# EAGLE design RCSfullschematic3 (EAGLE 7.6.0)
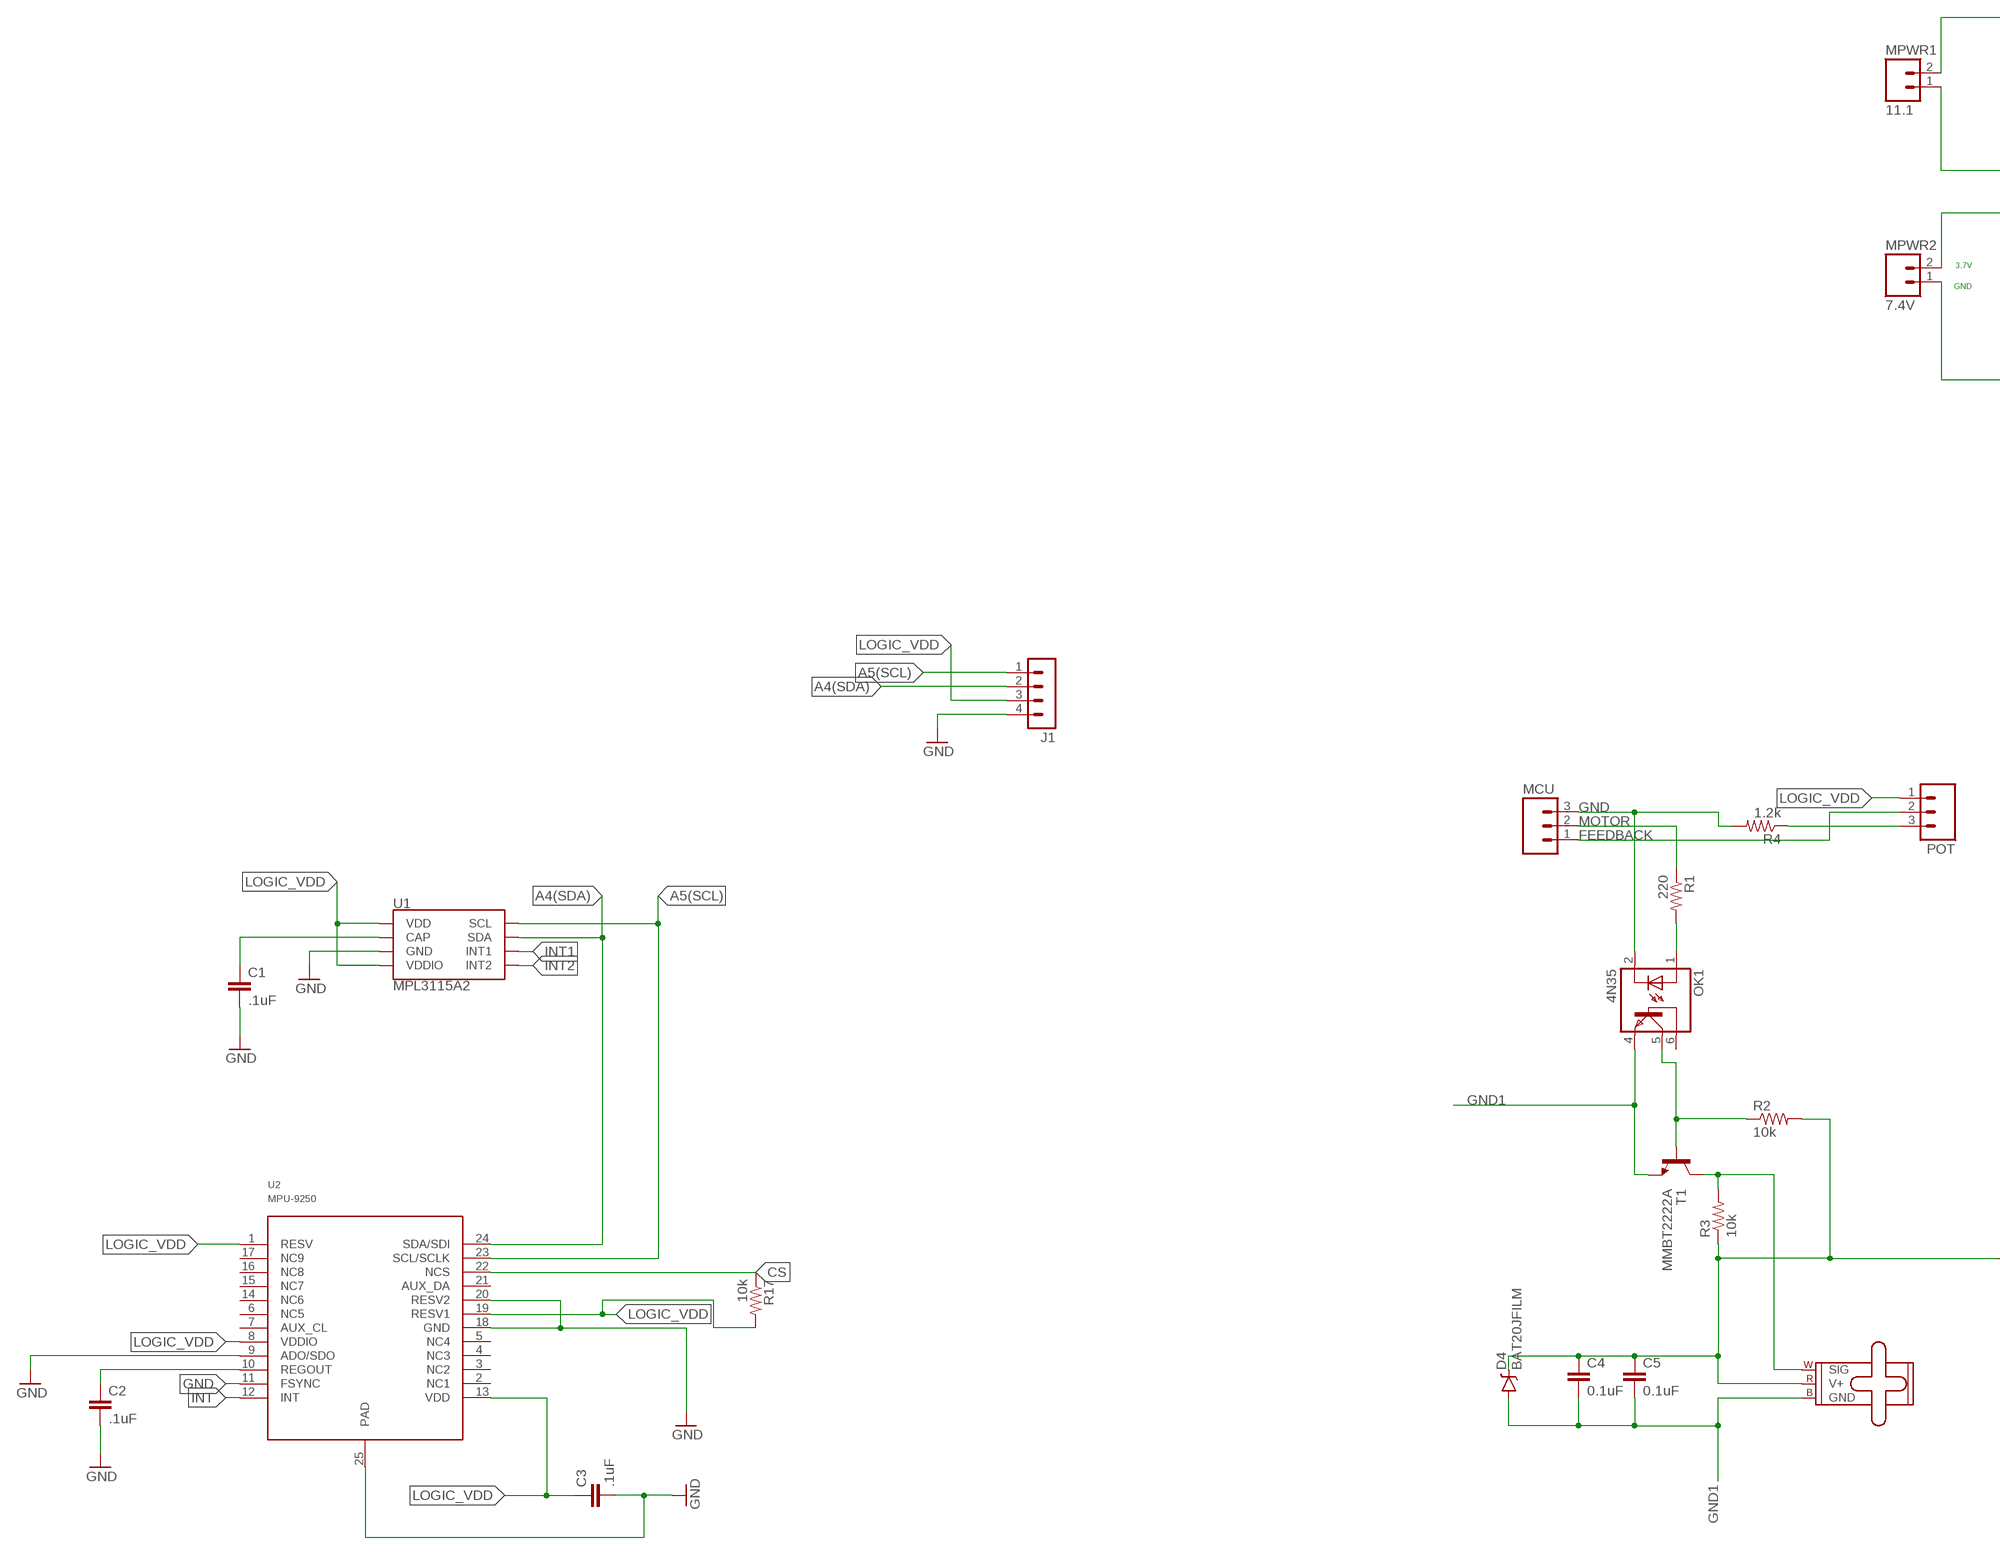
[diagram p0: schematic, sheet 1, part 1 of 2]
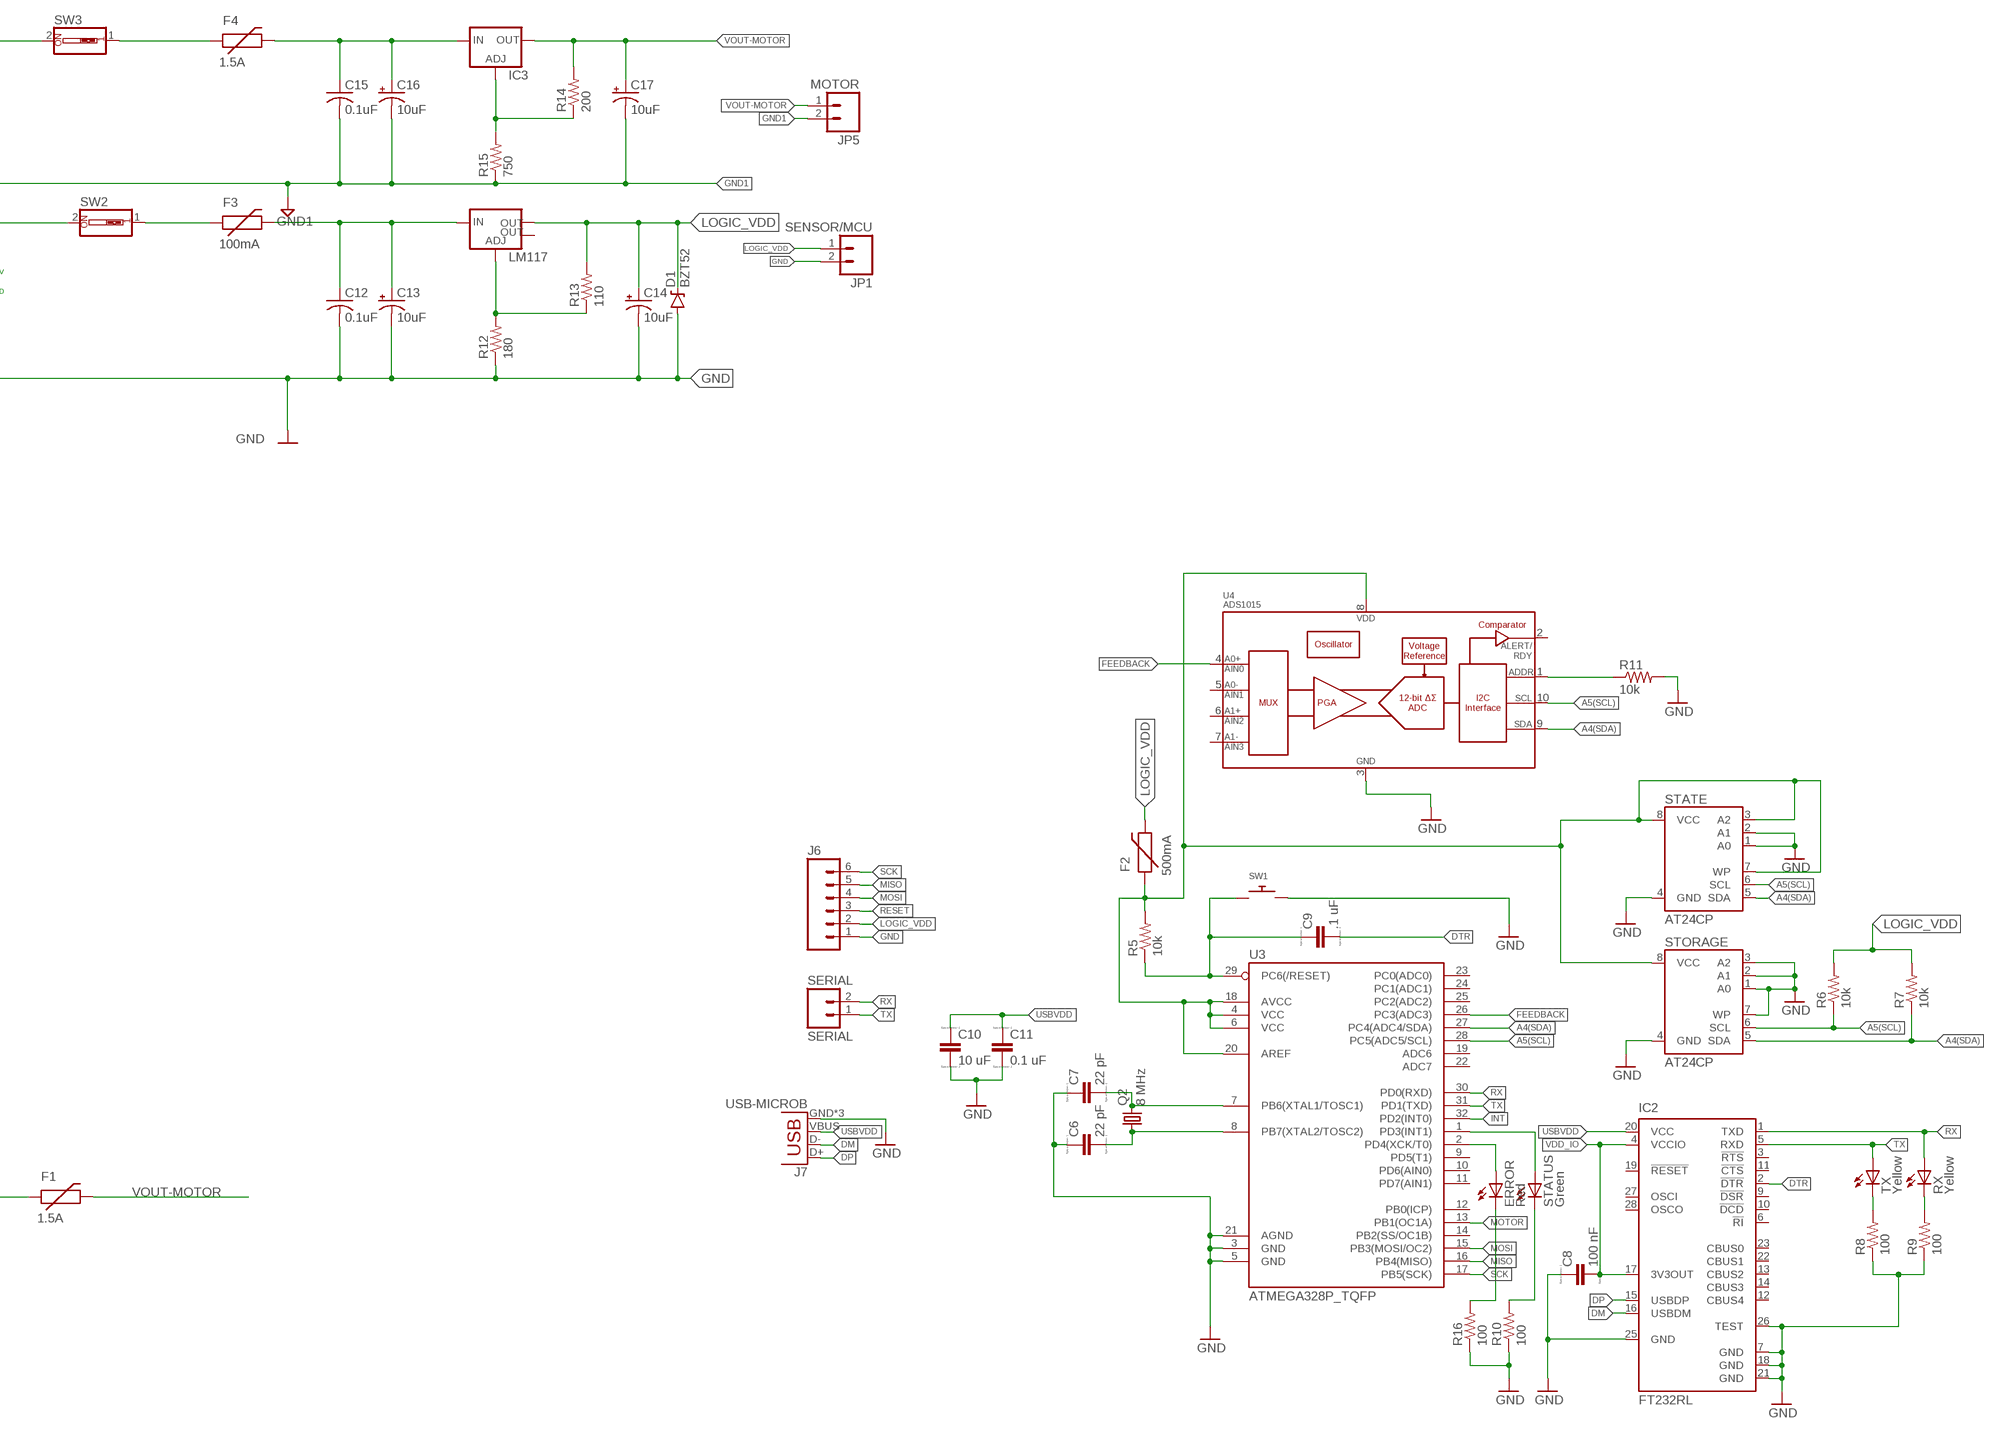
[diagram p1: schematic, sheet 1, part 2 of 2]

## Parts
C1  .1uF  10UF-1206-6.3V-20%  [1206]
C2  .1uF  10UF-1206-6.3V-20%  [1206]
C3  .1uF  10UF-1206-6.3V-20%  [1206]
C4  0.1uF  CAP1206  [1206]
C5  0.1uF  CAP1206  [1206]
C6  22 pF  CC1206  [C1206]
C7  22 pF  CC1206  [C1206]
C8  100 nF  CC1206  [C1206]
C9  .1 uF  CC1206  [C1206]
C10  10 uF  CC1206  [C1206]
C11  0.1 uF  CC1206  [C1206]
C12  0.1uF  C-USC1206  [C1206]
C13  10uF  10UF-POLAR-EIA3216-16V-10%(TANT)  [EIA3216]
C14  10uF  10UF-POLAR-EIA3216-16V-10%(TANT)  [EIA3216]
C15  0.1uF  C-USC1206  [C1206]
C16  10uF  10UF-POLAR-EIA3216-16V-10%(TANT)  [EIA3216]
C17  10uF  10UF-POLAR-EIA3216-16V-10%(TANT)  [EIA3216]
D1  BZT52  DIODE-ZENER  [DIODE-BZT52]
D4  BAT20JFILM  [SOD-323]
ERROR  Red  LEDCHIPLED_1206  [CHIPLED_1206]
F1  1.5A  PTCSMD  [PTC-1206]
F2  500mA  PTCSMD  [PTC-1206]
F3  100mA  PTCSMD  [PTC-1206]
F4  1.5A  PTCSMD  [PTC-1206]
IC2  FT232RL  [SSOP28]
IC3  LM317TS  [317TS]
J1  MA04-1  [MA04-1]
J6  M06LOCK  [1X06_LOCK]
J7  USB-MICROB  [USB-MICROB]
JP1  SENSOR/MCU  M02PTH  [1X02]
JP5  MOTOR  M02PTH  [1X02]
LM117  V_REG_LM1117SOT223  [SOT223]
MCU  M03PTH  [1X03]
MPWR1  11.1  M02PTH  [1X02]
MPWR2  7.4V  M02PTH  [1X02]
OK1  4N35  [DIL06]
POT  M03PTH  [1X03]
Q2  8 MHz  CRYSTALHC49S  [HC49/S]
R1  220  RESISTOR1206  [1206]
R2  10k  RESISTOR1206  [1206]
R3  10k  RESISTOR1206  [1206]
R4  1.2k  RESISTOR1206  [1206]
R5  10k  R-US_R1206  [R1206]
R6  10k  R-US_R1206  [R1206]
R7  10k  R-US_R1206  [R1206]
R8  100  R-US_R1206  [R1206]
R9  100  R-US_R1206  [R1206]
R10  100  R-US_R1206  [R1206]
R11  10k  R-US_R1206  [R1206]
R12  180  R-US_M1206  [M1206]
R13  110  R-US_M1206  [M1206]
R14  200  R-US_M1206  [M1206]
R15  750  R-US_M1206  [M1206]
R16  100  R-US_R1206  [R1206]
R17  10k  RESISTOR1206  [1206]
RX  Yellow  LEDCHIPLED_1206  [CHIPLED_1206]
SERIAL  SERIAL  M02PTH  [1X02]
SERVO  SMALL_SERVO  [1X03]
STATE  AT24CP  [DIL08]
STATUS  Green  LEDCHIPLED_1206  [CHIPLED_1206]
STORAGE  AT24CP  [DIL08]
SW1  SWITCH_PUSHBUTTONSOFTTOUCHSMD_SJ  [PUSHBUTTON_SMD_SJ]
SW2  SW_DIP-1  [EDG-01]
SW3  SW_DIP-1  [EDG-01]
T1  MMBT2222A  TRANSISTOR_NPNMMBT2222A  [SOT23-3]
TX  Yellow  LEDCHIPLED_1206  [CHIPLED_1206]
U1  MPL3115A2  [LGA-8]
U2  MPU-9250  [LEAD-QFN24]
U3  ATMEGA328P_TQFP  [TQFP32-08]
U4  ADS1015  [MSOP10]

## Nets
6V_POWER [Motor]: C4.1 C5.1 D4.C F1.1 R2.2 R3.1 SERVO.2(V+)
A4(SDA): J1.2 R7.1 STATE.5(SDA) STORAGE.5(SDA) U1.7(SDA) U2.24(SDA/SDI) U3.27(PC4(ADC4/SDA)) U4.9(SDA)
A5(SCL): J1.1 R6.1 STATE.6(SCL) STORAGE.6(SCL) U1.8(SCL) U2.23(SCL/SCLK) U3.28(PC5(ADC5/SCL)) U4.10(SCL)
CS: R17.1 U2.22(NCS)
DM: IC2.16(USBDM) J7.D-
DP: IC2.15(USBDP) J7.D+
DTR: C9.2 IC2.2(!DTR)
FEEDBACK: MCU.1 POT.2 U3.26(PC3(ADC3)) U4.4(AIN0)
GND: C1.2 C2.2 C3.2 C6.1 C7.1 C8.1 C10.2 C11.2 C12.2 C13.- C14.- D1.A IC2.7(GND) IC2.18(GND) IC2.21(GND) IC2.25(GND) IC2.26(TEST) J1.4 J6.1 J7.GND J7.MT1(GND) J7.MT2(GND) JP1.2 MCU.3 MPWR2.1 OK1.2(C) R4.2 R8.1 R9.1 R10.1 R11.2 R12.1 R16.1 STATE.1(A0) STATE.2(A1) STATE.4(GND) STORAGE.1(A0) STORAGE.2(A1) STORAGE.3(A2) STORAGE.4(GND) STORAGE.7(WP) SW1.P$2 U1.3(GND) U2.9(ADO/SDO) U2.11(FSYNC) U2.18(GND) U2.20(RESV2) U2.25(PAD) U3.3(GND) U3.5(GND) U3.21(AGND) U4.3(VSS)
GND1 [Motor]: C4.2 C5.2 C15.2 C16.- C17.- D4.A JP5.2 MPWR1.1 OK1.4(EMI) R15.1 SERVO.3(GND) T1.2(E)
INT: U2.12(INT) U3.32(PD2(INT0))
INT1: U1.6(INT1)
INT2: U1.5(INT2)
LOGIC_VDD: C3.1 C14.+ D1.C F2.2 J1.3 J6.2 JP1.1 LM117.2(OUT) POT.1 R6.2 R7.2 R13.2 R17.2 U1.1(VDD) U1.4(VDDIO) U2.1(RESV) U2.8(VDDIO) U2.13(VDD) U2.19(RESV1)
MISO: J6.5 U3.16(PB4(MISO))
MOSI: J6.4 U3.15(PB3(MOSI/OC2))
MOTOR: MCU.2 R1.1 U3.13(PB1(OC1A))
N$1: C1.1 U1.2(CAP)
N$2 [Motor]: OK1.5(COL) R2.1 T1.1(B)
N$3: C2.1 U2.10(REGOUT)
N$5: POT.3 R4.1
N$6: R11.1 U4.1(ADDR)
N$7: OK1.1(A) R1.2
N$8: C7.2 Q2.2 U3.7(PB6(XTAL1/TOSC1))
N$9: C6.2 Q2.1 U3.8(PB7(XTAL2/TOSC2))
N$10: R8.2 TX.C
N$11: R9.2 RX.C
N$12: STATUS.A U3.1(PD3(INT1))
N$13: R10.2 STATUS.C
N$14: ERROR.C R16.2
N$15: LM117.1(ADJ) R12.2 R13.1
N$16: MPWR2.2 SW2.2
N$17: C12.1 C13.+ F3.2 LM117.3(IN)
N$18: F3.1 SW2.1
N$19 [Motor]: MPWR1.2 SW3.2
N$20 [Motor]: F4.1 SW3.1
N$21 [Motor]: C15.1 C16.+ F4.2 IC3.3(IN)
N$22 [Motor]: IC3.1(ADJ) R14.1 R15.2
N$23: ERROR.A U3.2(PD4(XCK/T0))
RESET: C9.1 J6.3 R5.1 SW1.P$1 U3.29(PC6(/RESET))
RX: IC2.1(TXD) RX.A SERIAL.2 U3.30(PD0(RXD))
SCK: J6.6 U3.17(PB5(SCK))
SIGNAL [Motor]: R3.2 SERVO.1(SIG) T1.3(C)
TX: IC2.5(RXD) SERIAL.1 TX.A U3.31(PD1(TXD))
USBVDD: C10.1 C11.1 IC2.20(VCC) J7.VBUS
VCC: F2.1 R5.2 STATE.3(A2) STATE.7(WP) STATE.8(VCC) STORAGE.8(VCC) U3.4(VCC) U3.6(VCC) U3.18(AVCC) U3.20(AREF) U4.8(VDD)
VDD_IO: C8.2 IC2.4(VCCIO) IC2.17(3V3OUT)
VOUT-MOTOR [Motor]: C17.+ F1.2 IC3.2(OUT) JP5.1 R14.2
Unconnected: IC2.3(!RTS) IC2.6(!RI) IC2.9(!DSR) IC2.10(!DCD) IC2.11(!CTS) IC2.12(CBUS4) IC2.13(CBUS2) IC2.14(CBUS3) IC2.19(!RESET) IC2.22(CBUS1) IC2.23(CBUS0) IC2.27(OSCI) IC2.28(OSCO) LM117.4(OUT) OK1.6(BAS) U2.2(NC1) U2.3(NC2) U2.4(NC3) U2.5(NC4) U2.6(NC5) U2.7(AUX_CL) U2.14(NC6) U2.15(NC7) U2.16(NC8) U2.17(NC9) U2.21(AUX_DA) U3.9(PD5(T1)) U3.10(PD6(AIN0)) U3.11(PD7(AIN1)) U3.12(PB0(ICP)) U3.14(PB2(SS/OC1B)) U3.19(ADC6) U3.22(ADC7) U3.23(PC0(ADC0)) U3.24(PC1(ADC1)) U3.25(PC2(ADC2)) U4.2(ALERT/RDY) U4.5(AIN1) U4.6(AIN2) U4.7(AIN3)

## Notes on the sheet
- 3.7V
- GND

## Library data of the parts
C1-C3 = SparkFun-Capacitors:10UF: 10.0µF ceramic capacitors A capacitor is a passive two-terminal electrical component used to store electrical energy temporarily in an electric field.; PROD_ID: CAP-10057; VALUE: 10uF
C4 C5 = SparkFun-Passives:CAP: Capacitor Standard 0603 ceramic capacitor, and 0.1" leaded capacitor.
C6-C11 = eagle-ltspice:C: CAPACITOR, European symbol; SPICEMODEL: NONE; SPICEPREFIX: C
C12 C15 = rcl:C-US: CAPACITOR, American symbol
C13 C14 C16 C17 = SparkFun-Capacitors:10UF-POLAR: 10.0µF polarized capacitors A capacitor is a passive two-terminal electrical component used to store electrical energy temporarily in an electric field.; PROD_ID: CAP-00811
D1 = SparkFun-DiscreteSemi:DIODE-ZENER: Zener Diode Production Part - 8199 3.4V Zener Voltage; PROD-ID: DIO-08199
D4 = SparkFun-DiscreteSemi:BAT20JFILM: 23V, 1A Schottky diode, SOD-323 package; PROD_ID: DIO-11623
ERROR RX STATUS TX = adafruit:LED: LED OSRAM: - CHIPLED LG R971, LG N971, LY N971, LG Q971, LY Q971, LO R971, LY R971 LH N974, LH R974 LS Q976, LO Q976, LY Q976 LO Q996 - Hyper CHIPLED LW Q18S LB Q993, LB Q99A, LB R99A - SideLED LS A670, LO A670, LY A670, LG A670, LP A670 LB A673, LV A673, LT A673, LW A673 LH A674 LY A675 LS A676, LA A676, LO A676, LY A676, LW A676 LS A679, LY A679, LG A679 - Hyper Micro SIDELED® LS Y876, LA Y876, LO Y876, LY Y876 LT Y87S - SmartLED LW L88C, LW L88S LB L89C, LB L89S, LG L890 LS L89K, LO L89K, LY L89K LS L896, LA L896, LO L896, LY L896 - TOPLED LS T670, LO T670, LY T670, LG T670, LP T670 LSG T670, LSP T670, LSY T670, LOP T670, LYG T670 LG T671, LOG T671, LSG T671 LB T673, LV T673, LT T673, LW T673 LH T674 LS T676, LA T676, LO T676, LY T676, LB T676, LH T676, LSB T676, LW T676 LB T67C, LV T67C, LT T67C, LS T67K, LO T67K, LY T67K, LW E67C LS E67B, LA E67B, LO E67B, LY E67B, LB E67C, LV E67C, LT E67C LW T67C LS T679, LY T679, LG T679 LS T770, LO T770, LY T770, LG T770, LP T770 LB T773, LV T773, LT T773, LW T773 LH T774 LS E675, LA E675, LY E675, LS T675 LS T776, LA T776, LO T776, LY T776, LB T776 LHGB T686 LT T68C, LB T68C - Hyper Mini TOPLED® LB M676 - Mini TOPLED Santana® LG M470 LS M47K, LO M47K, LY M47K Source: http://www.osram.convergy.de/
F1-F4 = SparkFun-PowerIC:PTC: Resettable Fuse PTC Resettable Fuse. Spark Fun Electronics SKU : COM-08357; PROD_ID: RES-11150
IC2 = ftdichip:FT232R: Source: http://www.ftdichip.com/Documents/DataSheets/DS_FT232R_v104.pdf; MPN: FT232RL; OC_FARNELL: 1146032; OC_NEWARK: 91K9918
IC3 = v-reg:LM317TS: VOLTAGE REGULATOR
J1 = con-lstb:MA04-1: PIN HEADER; OC_FARNELL: unknown; OC_NEWARK: unknown
J6 = SparkFun-Connectors:M06: Header 6 Standard 6-pin 0.1" header. Use with straight break away headers (SKU : PRT-00116), right angle break away headers (PRT-00553), swiss pins (PRT-00743), machine pins (PRT-00117), and female headers (PRT-00115). Molex polarized connector foot print use with SKU : PRT-08094 with associated crimp pins and housings. NOTES ON THE VARIANTS LOCK and LOCK_LONGPADS... This footprint was designed to help hold the alignment of a through-hole component (i.e. 6-pin header) while soldering it into place. You may notice that each hole has been shifted either up or down by 0.005 of an inch from it's more standard position (which is a perfectly straight line). This slight alteration caused the pins (the squares in the middle) to touch the edges of the holes. Because they are alternating, it causes a "brace" to hold the component in place. 0.005 has proven to be the perfect amount of "off-center" position when using our standard breakaway headers. Although looks a little odd when you look at the bare footprint, once you have a header in there, the alteration is very hard to notice. Also,if you push a header all the way into place, it is covered up entirely on the bottom side. This idea of altering the position of holes to aid alignment will be further integrated into the Sparkfun Library for other footprints. It can help hold any component with 3 or more connection pins.
J7 = SparkFun-Connectors:USB: USB Connectors USB-B-PTH is fully proven SKU : PRT-00139/CONN-08278 USB-miniB is fully proven SKU : PRT-00587 USB-A-PCB is untested. USB-A-H is throughly reviewed, but untested. Spark Fun Electronics SKU : PRT-00437 USB-B-SMT is throughly reviewed, but untested. Needs silkscreen touching up. USB-A-S has not been used/tested USB-MB-H has not been used/tested USB-MICROB has been used. CONN-09505; PROD_ID: CONN-09505
JP1 JP5 MPWR1 MPWR2 SERIAL = SparkFun-Connectors:M02: Standard 2-pin 0.1" header. Use with - straight break away headers ( PRT-00116) - right angle break away headers (PRT-00553) - swiss pins (PRT-00743) - machine pins (PRT-00117) - female headers (PRT-00115) Molex polarized connector foot print use with: PRT-08233 with associated crimp pins and housings. 2.54_SCREWTERM for use with PRT-10571. 3.5mm Screw Terminal footprints for PRT-08084 5mm Screw Terminal footprints for use with PRT-08432
LM117 = SparkFun-IC-Power:V_REG_LM1117: Voltage Regulator LM1117 Standard adjustable voltage regulator but in SMD form. Spark Fun Electronics SKU : COM-00595; PROD_ID: VREG-08170
MCU POT = SparkFun-Connectors:M03: Header 3 Standard 3-pin 0.1" header. Use with straight break away headers (SKU : PRT-00116), right angle break away headers (PRT-00553), swiss pins (PRT-00743), machine pins (PRT-00117), and female headers (PRT-00115). Molex polarized connector foot print use with SKU : PRT-08232 with associated crimp pins and housings.
OK1 = optocoupler:4N35: MOTOROLA OPTO COUPLER; MF: FAIRCHILD SEMICONDUCTOR; MPN: 4N35; OC_FARNELL: 1328375; OC_NEWARK: 72K9946
Q2 = adafruit:CRYSTAL: CRYSTAL; OC_FARNELL: 1667008; OC_NEWARK: unknown
R1-R4 R17 = SparkFun-Passives:RESISTOR: Resistor Basic schematic elements and footprints for 0603, 1206, and PTH resistors.
R5-R11 R16 = adafruit:R-US_: RESISTOR, American symbol
R12-R15 = rcl:R-US_: RESISTOR, American symbol
SERVO = SparkFun-Electromechanical:SMALL_SERVO: Small servo motor This is the small servo used in the SIK. SKU: ROB-09065
STATE STORAGE = atmel:AT24C*: 2-wire serial EEPROM; MPN: AT24C1024BW-SH-B; OC_FARNELL: 1362646; OC_NEWARK: 03P2044
SW1 = adafruit:SWITCH_PUSHBUTTON: Buttons SOFTTOUCHSMD_SJ - Soft touch temporary push button (Super Junk Akihabara) Compatible with SKPMANE010 [Mouser: 688-SKPMAN] C&K_KSS = Digikey: KSS221GLFS
SW2 SW3 = special:SW_DIP-1: DIP SWITCH
T1 = SparkFun-DiscreteSemi:TRANSISTOR_NPN: Generic NPN BJT MMBT2222A - TRANS-08049 (SOT-23, 1A 40V) MPSA42 - TRANS-09116 (SOT-23, 500mA 300V) MMBT5088LT1G - TRANS-11160 (SOT-23, 50 mA 30V) BC547 - COM-08928 <http://www.sparkfun.com/products/8928> (TO-92 45V 100mA) (1.Collector 2.Base 3.Emitter) 2N3904 - COM-00521 <http://www.sparkfun.com/products/521> (TO-92 40V 200mA) (1.Emitter 2.Base 3.Collector) P2N2222A - COM-12852 <http://www.sparkfun.com/products/12852> (TO-92 40V 600mA) (1.Collector 2.Base 3.Emitter); PROD_ID: TRANS-08049
U1 = SparkFun-Sensors:MPL3115A2: NXP MPL3115A2 Digital Altimeter/Pressure Sensor The MPL3115A2 is a compact piezoresistive absolute pressure sensor with an I2C interface. MPL3115 has a wide operating range of 20kPa to 110 kPa, a range that covers all surface elevations on Earth. The fully internally compensated MEMS in conjunction with an embedded high resolution 24-bit equivalent ADC provide accurate pressure [Pascals] /altitude [meters] and temperature [degrees Celsius] data. Datasheet <http://cdn.sparkfun.com/datasheets/Sensors/Pressure/MPL3115A2.pdf> SparkFun Products SparkFun Altitude/Pressure Sensor Breakout - MPL3115A2 <https://www.sparkfun.com/products/11084> (SEN-11084) SparkFun Weather Shield <https://www.sparkfun.com/products/12081> (DEV-12081) SparkFun Photon Weather Shield <https://www.sparkfun.com/products/13630> (DEV-13630); PROD_ID: IC-10869
U2 = invensense copy:MPU-9250
U3 = SparkFun-DigitalIC:ATMEGA328P_TQFP; PROD_ID: IC-09069
U4 = SparkFun-AnalogIC:ADS1015: 12-Bit Del-Sig ADC Four single-ended inputs or two differential inputs Internal PGA I2C interface 2.0-5.5V; PROD_ID: IC-12239

## Net classes
1 Motor: width 0.699 mm

## Board
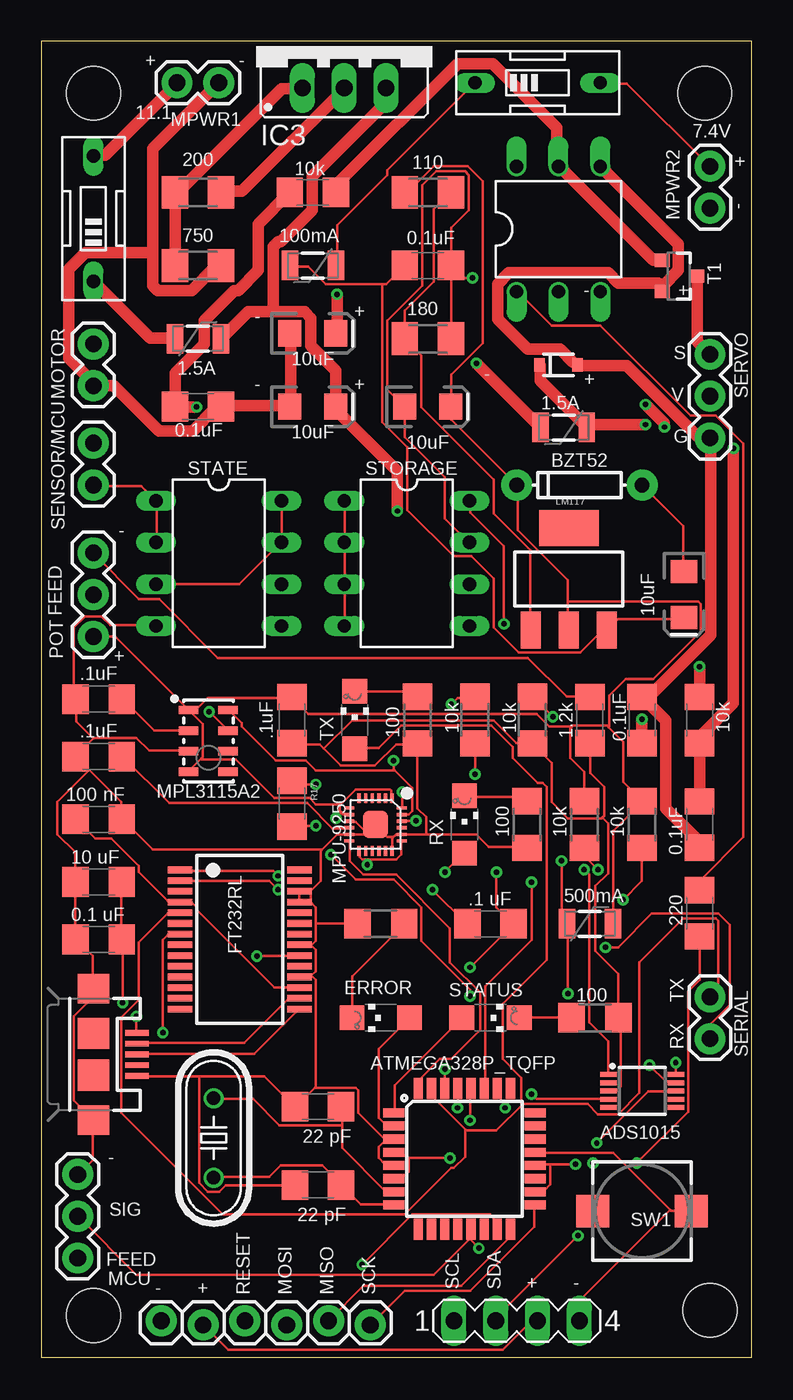
[diagram p2: board, top side]
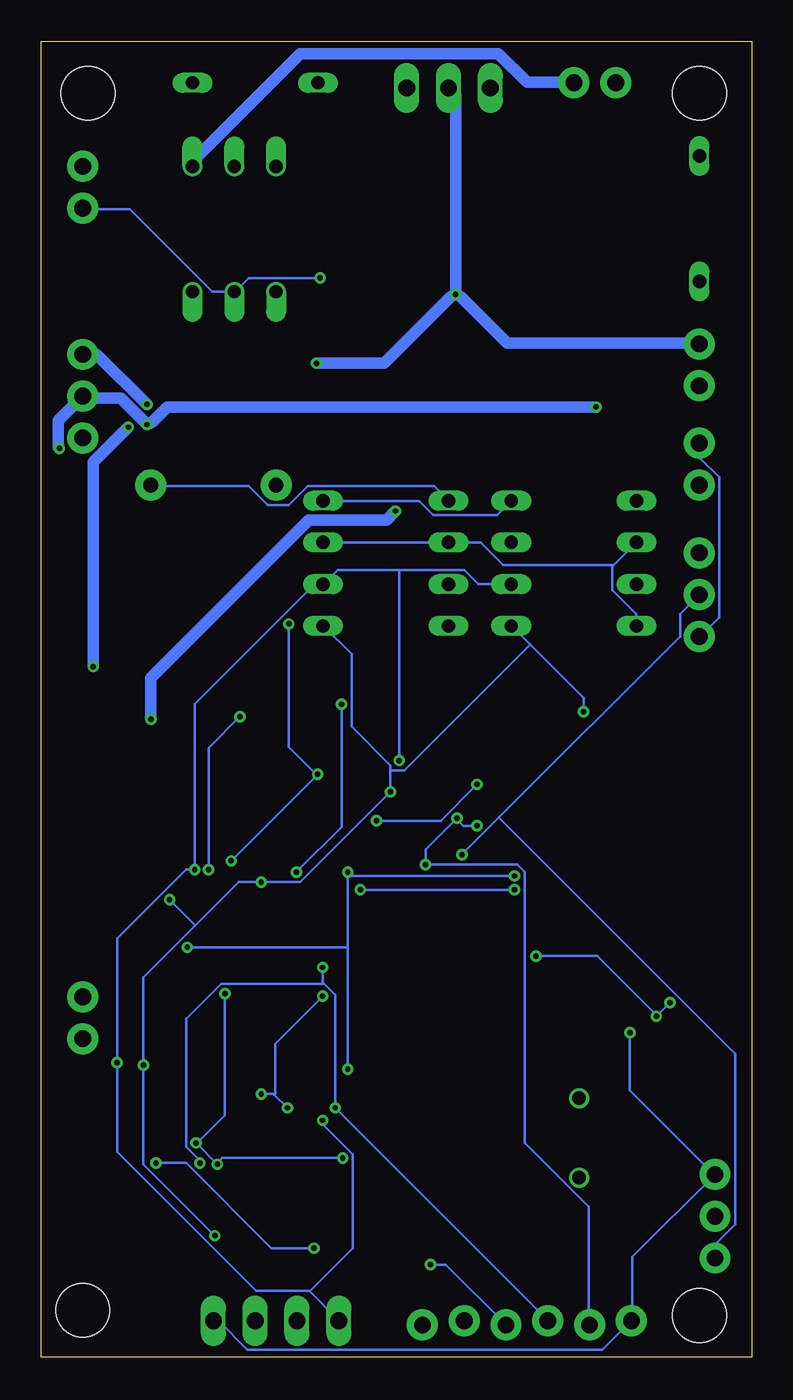
[diagram p3: board, bottom side, seen from below]

Size 43.17 x 80 mm. Coordinates in mm from the lower left corner, seen from the top.
Outline: 0,0 43.17,0 43.17,80 0,80 0,0
Copper layers (1*16): Top 0.0356mm / dielectric 1.5011mm / Bottom 0.0356mm
Design rules "LaenPCBOrder": minimum track width 6mil, minimum drill 13mil, track to track 6mil, track to pad 6mil, pad to pad 6mil, via to via 6mil, smd to smd 6mil, copper to edge 15mil, drill to drill 6mil, minimum pad ring 7mil, minimum via ring 7mil, stop-mask expansion 3mil, vias tented up to drill 0mil, thermal gap 10mil
Holes 3.26 mm at 3.17,76.83 40.32,76.83 40.64,2.86 3.17,2.54

### Footprints (pad centres in the part's own frame; a part is rotated, then mirrored left to right if it is on the bottom)
1206 = smd 1.6 x 1.8: 1 -1.4,0; 2 1.4,0
C1206 = smd 1.6 x 1.8: 1 -1.4,0; 2 1.4,0
EIA3216 = smd 1.4 x 1.6: + 1.4,0; - -1.4,0
DIODE-BZT52 = drill 0.9 pad 1.88: A -3.81,0; C 3.81,0
SOD-323 = smd 0.63 x 0.83: A 1.15,0; C -1.15,0
CHIPLED_1206 = smd 1.5 x 1.5: A 0,-1.75; C 0,1.75
PTC-1206 = smd 1 x 1.8: 1 -1.4,0; 2 1.4,0
SSOP28 = smd 0.4 x 1.5: 1 -4.225,-3.625; 2 -3.575,-3.625; 3 -2.925,-3.625; 4 -2.275,-3.625; 5 -1.625,-3.625; 6 -0.975,-3.625; 7 -0.325,-3.625; 8 0.325,-3.625; 9 0.975,-3.625; 10 1.625,-3.625; 11 2.275,-3.625; 12 2.925,-3.625; 13 3.575,-3.625; 14 4.225,-3.625; 15 4.225,3.625; 16 3.575,3.625; 17 2.925,3.625; 18 2.275,3.625; 19 1.625,3.625; 20 0.975,3.625; 21 0.325,3.625; 22 -0.325,3.625; 23 -0.975,3.625; 24 -1.625,3.625; 25 -2.275,3.625; 26 -2.925,3.625; 27 -3.575,3.625; 28 -4.225,3.625
317TS = drill 1.016 long: 1 -2.54,-2.54; 2 0,-2.54; 3 2.54,-2.54
MA04-1 = drill 1.016 long: 1 -3.81,0; 2 -1.27,0; 3 1.27,0; 4 3.81,0
1X06_LOCK = drill 1.016 pad 1.88: 1 0,0; 2 2.54,-0.254; 3 5.08,0; 4 7.62,-0.254; 5 10.16,0; 6 12.7,-0.254
USB-MICROB = smd 0.35 x 1.4: D+ 0,2.65; D- -0.65,2.65; GND 1.3,2.65; ID 0.65,2.65; VBUS -1.3,2.65 | smd 1.8 x 1.9: MT1 -4,0; MT2 4,0 | smd 1.9 x 1.9: P$1 -1.27,0; P$2 1.27,0
1X02 = drill 1.016 pad 1.88: 1 0,0; 2 2.54,0
SOT223 = smd 1.219 x 2.235: 1 -2.311,-3.099; 2 0,-3.099; 3 2.311,-3.099 | smd 3.6 x 2.2: 4 0,3.099
1X03 = drill 1.016 pad 1.88: 1 0,0; 2 2.54,0; 3 5.08,0
DIL06 = drill 0.813 offset: 1 -2.54,-3.81; 2 0,-3.81; 3 2.54,-3.81; 4 2.54,3.81; 5 0,3.81; 6 -2.54,3.81
HC49/S = drill 0.813: 1 -2.413,0; 2 2.413,0
R1206 = smd 1.6 x 1.803: 1 -1.422,0; 2 1.422,0
M1206 = smd 1.6 x 2: 1 -1.4,0; 2 1.4,0
DIL08 = drill 0.813 long: 1 -3.81,-3.81; 2 -1.27,-3.81; 3 1.27,-3.81; 4 3.81,-3.81; 5 3.81,3.81; 6 1.27,3.81; 7 -1.27,3.81; 8 -3.81,3.81
PUSHBUTTON_SMD_SJ = smd 2 x 2: P$1 3,0; P$2 -3,0
EDG-01 = drill 0.813 long: 1 0,-3.81; 2 0,3.81
SOT23-3 = smd 0.8 x 0.9: 1 -0.95,-1; 2 0.95,-1; 3 0,1.1
LGA-8 = smd 1.2 x 0.5: 1 -1.2,1.875; 2 -1.2,0.625; 3 -1.2,-0.625; 4 -1.2,-1.875; 5 1.2,-1.875; 6 1.2,-0.625; 7 1.2,0.625; 8 1.2,1.875
LEAD-QFN24 = smd 0.6 x 0.2: 1 -1.6,1; 2 -1.6,0.6; 3 -1.6,0.2; 4 -1.6,-0.2; 5 -1.6,-0.6; 6 -1.6,-1; 13 1.6,-1; 14 1.6,-0.6; 15 1.6,-0.2; 16 1.6,0.2; 17 1.6,0.6; 18 1.6,1 | smd 0.2 x 0.6: 7 -1,-1.6; 8 -0.6,-1.6; 9 -0.2,-1.6; 10 0.2,-1.6; 11 0.6,-1.6; 12 1,-1.6; 19 1,1.6; 20 0.6,1.6; 21 0.2,1.6; 22 -0.2,1.6; 23 -0.6,1.6; 24 -1,1.6 | smd 1.7 x 1.54: 25 0,0
TQFP32-08 = smd 1.27 x 0.559: 1 -4.293,2.8; 2 -4.293,2; 3 -4.293,1.2; 4 -4.293,0.4; 5 -4.293,-0.4; 6 -4.293,-1.2; 7 -4.293,-2; 8 -4.293,-2.8; 17 4.293,-2.8; 18 4.293,-2; 19 4.293,-1.2; 20 4.293,-0.4; 21 4.293,0.4; 22 4.293,1.2; 23 4.293,2; 24 4.293,2.8 | smd 0.559 x 1.27: 9 -2.8,-4.293; 10 -2,-4.293; 11 -1.2,-4.293; 12 -0.4,-4.293; 13 0.4,-4.293; 14 1.2,-4.293; 15 2,-4.293; 16 2.8,-4.293; 25 2.8,4.293; 26 2,4.293; 27 1.2,4.293; 28 0.4,4.293; 29 -0.4,4.293; 30 -1.2,4.293; 31 -2,4.293; 32 -2.8,4.293
MSOP10 = smd 0.3 x 1: 1 -1,-2.05; 2 -0.5,-2.05; 3 0,-2.05; 4 0.5,-2.05; 5 1,-2.05; 6 1,2.05; 7 0.5,2.05; 8 0,2.05; 9 -0.5,2.05; 10 -1,2.05

### Placement (x,y rotation side)
C1  3.49,40.01 180 top
C2  3.49,36.51 180 top
C3  15.24,38.73 270 top
C4  40.01,32.38 270 top
C5  9.53,57.78 0 top
C6  16.83,10.48 0 top
C7  16.83,15.24 0 top
C8  3.49,32.7 180 top
C9  27.3,26.35 180 top
C10  3.49,28.89 180 top
C11  3.49,25.4 180 top
C12  23.5,66.36 0 top
C13  39.05,46.35 270 top
C14  23.5,57.78 0 top
C15  36.51,38.73 90 top
C16  16.51,57.78 0 top
C17  16.51,62.23 0 top
D1  32.7,53.02 180 top
D4  31.43,60.33 0 top
ERROR  20.64,20.64 90 top
F1  31.75,56.52 180 top
F2  33.34,26.35 0 top
F3  16.51,66.36 180 top
F4  9.53,61.91 0 top
IC2  12.06,25.4 270 top
IC3  18.41,79.69 0 top
J1  28.89,2.22 0 top
J6  7.3,2.22 0 top
J7  3.17,18.41 270 top
JP1  3.17,55.56 270 top
JP5  3.17,61.59 270 top
LM117  32.07,47.31 0 top
MCU  2.22,6.03 90 top
MPWR1  10.79,77.47 180 top
MPWR2  40.64,69.85 90 top
OK1  31.43,68.58 0 top
POT  3.17,43.81 90 top
Q2  10.48,13.34 90 top
R1  40.01,26.99 90 top
R2  16.51,70.8 180 top
R3  40.01,38.73 90 top
R4  33.34,38.73 270 top
R5  26.35,38.73 270 top
R6  33.02,32.38 90 top
R7  36.51,32.38 90 top
R8  22.86,38.73 90 top
R9  29.53,32.38 90 top
R10  33.66,20.64 180 top
R11  29.84,38.73 270 top
R12  23.5,61.91 180 top
R13  23.5,70.8 180 top
R14  9.53,70.8 0 top
R15  9.53,66.36 180 top
R16  20.64,26.35 0 top
R17  15.24,33.66 270 top
RX  25.72,32.38 0 top
SERIAL  40.64,21.91 270 top
SERVO  40.64,60.96 270 top
STATE  10.79,48.26 270 top
STATUS  27.3,20.64 270 top
STORAGE  22.23,48.26 270 top
SW1  36.51,8.89 180 top
SW2  30.16,77.47 270 top
SW3  3.17,69.22 0 top
T1  38.73,65.72 270 top
TX  19.05,38.73 0 top
U1  10.16,37.47 0 top
U2  20.32,32.38 270 top
U3  25.72,12.06 0 top
U4  36.51,16.19 270 top

### Tracks (layer width: path | path; a pad name or v marks a point on that pad's centre or on a via)
6V_POWER  (via drill 0.33)
  Top 0.699: R2.2 15.09,70.79 13.18,68.89 13.18,66.06 11.96,64.85 11.73,64.85 9.91,63.02 9.91,61.57 8.15,59.82 8.15,57.84 C5.1 8.46,57.76 v9.45,57.76 | D4.C 30.33,60.27 30.33,59.36 33.15,56.54 F1.1 33.45,56.69 v36.73,56.69 | C4.1 R3.1 40.16,37.64 40.16,37.87 42.06,39.78 v42.06,55.24
  Bottom 0.699: v42.06,55.24 42.14,55.32 42.14,56.92 SERVO.2 40.31,58.29 38.33,58.29 v36.73,56.69 36.42,56.84 35.51,57.76 v9.45,57.76
A4(SDA)  (via drill 0.33)
  Top 0.152: v10.21,39.24 U1.7 | v21.95,34.37 21.95,33.45 U2.24 | v36.96,17.75 37.95,16.76 38.56,16.76 U4.9 | v29.79,28.88 29.79,25.38 26.98,22.55 26.98,16.38 U3.27 | v35.36,27.81 36.5,28.96 36.5,30.94 R7.1 | v32.61,7.39 27.66,2.44 27.66,2.29 J1.2
  Bottom 0.152: v10.21,39.24 10.21,40.08 13.45,43.32 | 13.45,43.32 14.55,44.42 STATE.5 | 21.95,35.66 21.95,35.97 24.31,38.33 24.31,42.75 25.98,44.42 STORAGE.5 | 21.95,35.66 v21.95,34.37 27.43,28.88 v29.79,28.88 31.17,28.88 33.8,26.25 | 33.8,26.25 36.96,23.09 v36.96,17.75 36.96,11.73 v32.61,7.39 | 33.8,26.25 v35.36,27.81 | 13.45,43.32 21.11,35.66 21.95,35.66
A5(SCL)  (via drill 0.33)
  Top 0.152: 21.41,35.66 16.69,35.66 16.08,36.27 14.25,36.27 12.19,38.33 12.19,38.56 11.43,39.32 U1.8 | 21.41,35.66 21.49,35.66 22.55,34.59 22.55,33.22 22.33,32.99 21.95,32.99 U2.23 | v38.56,17.91 38.56,17.22 U4.10 | v26.06,14.4 26.06,16.31 U3.28 | v33.83,29.64 33.07,30.4 33.07,30.94 R6.1 | v21.41,36.27 21.41,35.66
  Bottom 0.152: 21.41,47.85 25.15,47.85 25.98,47.02 STORAGE.6 26.06,46.94 26.59,46.94 33.83,39.7 v33.83,29.64 34.37,29.64 38.56,25.45 v38.56,17.91 38.56,12.5 30.1,4.04 26.9,4.04 26.86,4 | 21.41,47.85 17.45,47.85 16.61,47.02 14.63,47.02 STATE.6 | J1.1 26.86,4 | v26.06,14.4 26.06,14.17 24.23,12.34 24.23,6.63 26.86,4 | 21.41,47.85 v21.41,36.27
CS  (via drill 0.33)
  Top 0.152: v22.78,32.61 21.95,32.61 U2.22 | v16.69,34.82 15.47,34.82 R17.1
  Bottom 0.152: v22.78,32.61 18.9,32.61 v16.69,34.82
DM
  Top 0.152: J7.D- 5.87,19.13 12.34,19.13 15.01,21.79 15.62,21.79 IC2.16
DP
  Top 0.152: J7.D+ 5.87,18.44 12.95,18.44 15.62,21.11 IC2.15
DTR  (via drill 0.33)
  Top 0.152: v14.4,28.42 13.87,28.96 8.46,28.96 IC2.2 | v23.77,28.42 25.83,26.36 C9.2
  Bottom 0.152: v23.77,28.42 v14.4,28.42
FEEDBACK  (via drill 0.33)
  Top 0.152: v29.79,16 30.1,15.7 34.44,15.7 U4.4 | v28.19,15.16 28.19,15.39 27.74,15.85 27.74,16.31 U3.26 | v26.06,21.95 26.06,22.33 23.09,25.3 23.09,27.36 21.41,29.03 19.13,29.03 v17.6,30.56
  Bottom 0.152: v29.79,16 29.03,16 28.99,15.96 | v28.19,15.16 28.99,15.96 | v26.06,21.95 28.96,19.05 28.96,16 28.99,15.96 | 15.35,32.8 4.34,43.81 4.34,45.19 POT.2 | 15.35,32.8 v17.6,30.56 | 15.35,32.8 0.99,18.44 0.99,8.08 2.21,6.86 2.21,6.1 MCU.1
GND  (via drill 0.33)
  Top 0.152: U4.3 34.52,16.23 34.98,16.23 35.2,16.46 35.2,20.5 35.13,20.57 R10.1 35.05,20.65 35.05,23.32 33.68,24.69 33.68,28.65 34.44,29.41 34.44,32.46 34.1,32.8 | 34.1,32.8 34.06,32.77 32,32.77 31.01,33.76 31.01,36.12 29.87,37.26 R11.2 29.79,37.34 28.88,37.34 27.51,38.71 18.9,38.71 17.18,36.99 | 34.1,32.8 34.21,32.92 34.21,34.67 33.38,35.51 33.38,37.26 R4.2 | U3.5 21.41,11.73 20.88,11.73 20.5,12.12 20.5,12.8 20.95,13.26 U3.3 20.88,13.26 19.28,14.86 19.28,16.23 19.13,16.38 16.69,16.38 | 9.6,17.07 13.56,17.07 15.39,15.24 C7.1 15.47,15.24 16.61,16.38 16.69,16.38 | 9.6,17.07 5.87,17.07 J7.GND | 9.6,17.07 9.6,10.59 10.13,10.06 10.82,10.06 11.2,10.44 15.39,10.44 C6.1 | IC2.25 15.7,27.74 15.7,28.27 IC2.26 | 16.42,23.2 16.69,23.47 16.69,24.77 16.42,25.03 | 16.42,23.2 16.38,23.16 15.7,23.16 IC2.18 | 16.42,25.03 16.38,25.07 IC2.21 | 16.69,26.36 16.69,25.3 16.42,25.03 | 16.69,26.36 16.69,27.36 16.31,27.74 15.77,27.74 IC2.25 | 16.69,26.36 19.2,26.36 R16.1 | 17.18,36.99 18.21,35.97 20.27,35.97 21.57,37.26 22.86,37.26 | 17.18,36.99 16.92,37.26 15.24,37.26 C3.2 | 21.37,31.59 21.57,31.77 21.87,31.77 U2.20 21.95,31.77 23.39,31.77 | 21.37,31.59 21.34,31.55 21.34,30.86 U2.18 | U2.25 20.27,32.38 19.66,31.77 18.75,31.77 U2.11 18.67,31.77 17.98,31.77 17.03,30.82 | U2.9 18.75,32.54 19.13,32.54 19.74,31.93 U2.25 | 21.37,31.59 21.34,31.62 21.03,31.62 20.34,32.31 U2.25 | 23.39,31.77 26.44,31.77 27.2,31.01 29.49,31.01 R9.1 | 22.86,37.26 22.86,33.38 23.39,32.84 23.39,31.77 | 22.86,37.26 R8.1 | 17.03,30.82 16.99,30.79 16.99,28.96 16.38,28.35 16.38,27.74 IC2.25 | 16.69,16.38 16.69,22.94 16.42,23.2
  Top 0.152: 24.92,65.61 24.92,61.95 R12.1 | 24.92,65.61 24.92,66.29 C12.2 | v26.21,65.61 24.92,65.61 | 24.92,65.61 C12.2 | D1.A 39.01,50.52 39.01,47.78 C13.- | STORAGE.4 18.44,44.5 18.44,46.94 STORAGE.3 18.44,47.02 18.44,49.53 | 18.44,49.53 18.44,52.05 STORAGE.1 | 18.44,49.53 STORAGE.2 | STORAGE.7 25.98,49.53 24.54,50.98 24.54,53.49 22.1,55.93 22.1,57.76 C14.- 22.02,57.84 21.03,58.83 21.03,63.02 23.16,65.15 23.16,71.25 24,72.08 25.76,72.08 25.98,71.86 25.98,69.72 24.92,68.66 24.92,66.37 C12.2 | STATE.2 7.01,49.53 7.01,52.05 STATE.1 6.1,52.96 3.2,52.96 JP1.2 | 3.16,37.6 2.13,36.58 C2.2 2.13,36.5 2.93,35.7 | 3.16,37.6 3.2,37.64 5.79,37.64 6.55,36.88 8.91,36.88 U1.3 | 3.16,37.6 2.13,38.63 2.13,40.01 C1.2 2.06,40.01 1.98,40.08 1.98,44.35 2.67,45.03 3.66,45.03 4.19,44.5 6.93,44.5 STATE.4 | 2.93,35.7 4.88,33.76 4.88,32.77 C8.1 4.95,32.69 6.78,30.86 16.99,30.86 17.03,30.82 | 2.93,35.7 0.99,33.76 0.99,31.77 2.06,30.71 2.06,28.96 C10.2 2.06,28.88 2.06,25.45 C11.2 2.13,25.38 3.12,24.38 3.12,22.48 J7.MT1 3.12,22.4 3.12,21.87 1.98,20.73 1.98,15.62 3.12,14.48 J7.MT2 3.12,14.4 3.12,11.96 2.29,11.12 MCU.3 | 38.21,8.95 38.25,8.91 39.47,8.91 SW1.P$2 | 38.21,8.95 34.75,12.42 30.02,12.42 U3.21 | 38.21,8.95 32.77,3.5 32.77,2.29 J1.4 | v7.39,19.74 7.39,25.38 7.7,25.68 8.38,25.68 IC2.7
  Bottom 0.152: MPWR2.1 40.62,69.8 37.8,69.8 32.77,64.77 OK1.2 31.39,64.77 30.56,65.61 v26.21,65.61 | STORAGE.7 STORAGE.2 16.46,49.53 15.09,48.16 8.46,48.16 8.42,48.12 | D1.A 36.5,52.96 30.56,52.96 29.41,51.82 28.12,51.82 26.98,52.96 19.28,52.96 18.44,52.12 STORAGE.1 | 8.42,48.12 7.01,49.53 STATE.2 | 8.42,48.12 8.46,48.08 8.46,46.63 7.01,45.19 7.01,44.5 STATE.4 | v7.39,19.74 7.39,16.23 2.29,11.12 MCU.3 7.24,6.1 7.24,2.29 J6.1 9.07,0.46 30.63,0.46 32.38,2.21 J1.4
GND1
  Top 0.699: 6.78,67.13 6.78,73.46 MPWR1.1 | 6.78,67.13 6.78,65.15 7.09,64.85 9.14,64.85 10.59,66.29 10.9,66.29 R15.1 | C17.- 15.16,62.18 15.16,58.14 C16.- 15.09,57.84 10.97,57.84 C5.2 10.59,57.68 9.22,56.31 7.16,56.31 4.42,59.05 JP5.2 3.05,59.36 1.68,60.73 1.68,66.14 2.67,67.13 6.78,67.13 | C4.2 40.01,31.32 37.95,33.38 37.95,38.71 36.58,40.08 C15.2 36.96,40.16 40.69,43.89 40.69,55.55 SERVO.3 40.62,55.93 39.93,55.93 35.59,60.27 32.61,60.27 D4.A 32.31,60.5 31.55,61.27 29.57,61.27 27.74,63.09 27.74,65.23 28.42,65.91 34.44,65.91 35.05,65.3 37.49,65.3 37.8,65.15 | 37.8,65.15 37.8,64.85 T1.2 | 37.8,65.15 38.71,66.06 38.71,67.67 33.98,72.39 OK1.4
  Bottom 0.699: MPWR1.1 10.82,77.5 13.64,77.5 15.39,79.25 27.43,79.25 33.91,72.77 33.91,72.39 OK1.4
INT
  Top 0.152: U2.12 18.75,31.32 18.75,30.18 19.58,29.34 21.57,29.34 24.84,26.06 24.84,24 26.67,22.17 26.67,19.89 24.92,18.14 24.23,18.14 22.94,16.84 22.94,16.38 U3.32
LOGIC_VDD  (via drill 0.33)
  Top 0.152: R13.2 22.1,70.87 22.33,70.87 23.85,72.39 25.91,72.39 26.82,71.48 26.82,61.65 24.92,59.74 24.92,57.84 C14.+ 24.92,57.76 24.92,57 D1.C 28.96,52.96 28.96,50.29 32,47.24 32,45.95 | 32,45.95 32,44.27 LM117.2 | J6.2 11.35,0.46 28.04,0.46 29.79,2.21 30.1,2.21 J1.3 | F2.2 34.75,26.36 34.75,32 36.5,33.76 R7.2 36.5,33.83 35.36,34.98 35.36,37.41 34.48,38.29 | 32.19,38.29 32.31,38.41 34.37,38.41 34.48,38.29 | 32.19,38.29 32.16,38.25 32.16,36.42 32.99,35.59 32.99,33.83 R6.2 | 19.81,30.25 21.57,30.25 21.87,30.56 21.87,31.32 U2.19 | 19.81,30.25 19.51,30.25 19.36,30.4 19.36,30.79 U2.13 | 18.25,33.11 18.14,33.22 18.14,33.53 18.17,33.57 | 18.25,33.11 18.36,32.99 18.67,32.99 U2.8 | 18.17,33.57 19.13,34.52 21.18,34.52 21.26,34.44 21.26,33.98 U2.1 | v19.81,29.95 19.81,30.25 | 18.25,33.11 v17.91,32.77 | v16.69,32.31 15.24,32.31 R17.2 | 9.72,36.39 9.83,36.5 9.83,38.48 8.99,39.32 U1.1 | 9.72,36.39 8.99,35.66 U1.4 | 15.24,40.08 10.13,40.08 9.22,39.17 U1.1 | POT.1 4.5,43.81 8.91,39.4 U1.1 | 18.17,33.57 18.14,33.6 16.69,33.6 16.31,33.98 14.17,33.98 11.81,36.35 9.75,36.35 9.72,36.39 | 15.24,40.08 16.23,39.09 30.1,39.09 30.86,38.33 32.16,38.33 32.19,38.29 | 15.24,40.08 C3.1 | 32,45.95 39.93,45.95 40.08,45.8 40.08,44.12 37.19,41.22 35.51,41.22 34.52,40.23 34.52,38.33 34.48,38.29
  Bottom 0.152: v16.69,32.31 17.53,32.31 17.91,32.69 v17.91,32.77 19.81,30.86 v19.81,29.95 14.25,29.95 13.79,29.49 13.79,13.03 9.91,9.14 9.91,1.98 J6.2 | JP1.1 3.12,55.55 3.12,54.63 1.98,53.49 1.98,44.96 3.12,43.81 POT.1
MISO
  Top 0.152: J6.5 19.58,4.34 25.53,4.34 28.5,7.32 28.5,7.77 U3.16
MOSI  (via drill 0.33)
  Top 0.152: v19.51,5.64 22.55,8.69 27.28,8.69 27.66,8.31 27.66,7.77 U3.15
  Bottom 0.152: v19.51,5.64 18.59,5.64 J6.4
MOTOR  (via drill 0.33)
  Top 0.152: MCU.2 2.29,8.53 5.79,5.03 23.85,5.03 26.06,7.24 26.06,7.77 U3.13 26.06,7.16 v26.59,6.63 | R1.1 40.01,22.94 39.32,22.25 39.32,14.94 v36.2,11.81
  Bottom 0.152: v36.2,11.81 34.37,11.81 29.18,6.63 v26.59,6.63
N$1
  Top 0.152: U1.2 8.91,38.1 6.86,38.1 4.95,40.01 C1.1
N$2
  Top 0.699: T1.1 37.19,66.67 31.47,72.39 OK1.5 31.32,72.69 31.32,74.75 27.43,78.64 25.3,78.64 17.98,71.32 17.98,70.87 R2.1
N$3
  Top 0.152: U2.10 18.67,32.16 17.68,32.16 16.15,33.68 7.77,33.68 4.95,36.5 C2.1
N$5
  Top 0.152: R4.1 33.3,40.16 31.93,40.16 29.57,42.52 10.74,42.52 7.16,46.1 5.94,46.1 3.2,48.84 POT.3
N$6  (via drill 0.33)
  Top 0.152: v32.99,29.64 33.3,29.34 33.3,20.34 34.44,19.2 34.44,17.22 U4.1 | v31.09,38.94 29.87,40.16 R11.1
  Bottom 0.152: v32.99,29.64 32.99,37.03 v31.09,38.94
N$7
  Top 0.152: R1.2 40.01,28.96 42.67,31.62 42.67,55.55 41,57.23 39.47,57.23 33.98,62.71 31.01,62.71 28.96,64.77 OK1.1
N$8
  Top 0.152: 18.29,14.1 18.29,15.24 C7.2 | 18.29,14.1 18.29,12.72 20.88,10.13 21.41,10.13 U3.7 | 18.29,14.1 14.48,14.1 12.88,15.7 10.52,15.7 Q2.2
N$9
  Top 0.152: U3.8 21.41,9.3 19.43,9.3 18.29,10.44 C6.2 18.21,10.52 17.07,11.66 14.55,11.66 13.87,10.97 10.52,10.97 Q2.1
N$10
  Top 0.152: R8.2 22.55,40.46 19.05,40.46 TX.C | R8.2
N$11
  Top 0.152: RX.C 25.76,34.06 29.26,34.06 29.49,33.83 R9.2
N$12
  Top 0.152: U3.1 21.49,14.94 21.49,16.54 25.53,20.57 STATUS.A
N$13
  Top 0.152: STATUS.C 29.11,20.65 R10.2
N$14
  Top 0.152: ERROR.C 18.9,23.16 22.02,26.29 R16.2
N$15
  Top 0.152: R13.1 24.84,70.79 23.85,69.8 23.85,65.38 22.1,63.63 22.1,61.95 R12.2 22.1,61.87 23.09,60.88 23.09,57.76 27.51,53.34 27.51,51.28 29.72,49.07 29.72,44.27 LM117.1
N$16
  Top 0.152: SW2.2 33.98,77.42 35.59,77.42 40.62,72.39 MPWR2.2
N$17
  Top 0.152: C13.+ 39.01,44.88 35.05,44.88 LM117.3 34.37,44.2 34.14,44.2 32.77,42.82 29.03,42.82 27.51,44.35 27.51,47.32 26.14,48.69 25.07,48.69 22.25,51.51 22.25,55.32 20.73,56.84 20.73,65.23 | 20.73,65.23 20.95,65.23 22.02,66.29 C12.1 | 20.73,65.23 17.3,65.23 16.23,66.29 15.16,66.29 F3.2
N$18
  Top 0.152: F3.1 17.98,66.37 17.98,68.81 21.03,71.86 21.03,72.16 26.29,77.42 SW2.1
N$19
  Top 0.699: SW3.2 3.2,73.08 3.89,73.08 8.23,77.42 MPWR1.2
N$20
  Top 0.699: SW3.1 6.63,61.95 8.08,61.95 F4.1
N$21  (via drill 0.33)
  Top 0.699: 14.1,63.55 12.57,63.55 10.97,61.95 F4.2 | 14.1,63.55 16,63.55 16.38,63.17 16.38,61.49 17.91,59.97 17.91,57.84 C16.+ 18.06,57.45 21.64,53.87 v21.64,51.44 | v36.5,38.79 C15.1 | IC3.3 20.95,76.28 16.46,71.78 16.46,69.72 14.55,67.82 14.4,67.82 14.1,67.51 14.1,63.55
  Bottom 0.699: v36.5,38.79 36.5,41.3 26.9,50.9 22.17,50.9 v21.64,51.44
N$22
  Top 0.699: R15.2 8.15,66.37 8.15,70.79 R14.1 8.46,70.94 14.63,77.11 15.85,77.11 IC3.1
N$23
  Top 0.152: U3.2 21.41,14.1 20.95,14.1 20.5,14.55 20.5,18.75 22.33,20.57 ERROR.A
RESET  (via drill 0.33)
  Top 0.152: v25.3,15.16 25.3,16.31 U3.29 | v26.06,23.7 28.65,26.29 C9.1 28.65,26.36 27.66,27.36 v27.66,29.49 | v24.92,39.7 25.3,40.08 26.29,40.08 R5.1 | v33.53,11.81 33.53,8.91 SW1.P$1
  Bottom 0.152: J6.3 12.42,2.29 v25.3,15.16 25.3,22.02 26.02,22.75 | v26.06,23.7 26.06,22.78 26.02,22.75 | v24.92,39.7 24.92,32.23 v27.66,29.49 | v33.53,11.81 33.53,11.96 34.37,12.8 34.37,20.57 32.23,22.71 26.06,22.71 26.02,22.75
RX  (via drill 0.33)
  Top 0.152: v24.54,17.53 24.54,16.38 U3.30 | v24.54,29.49 25.68,30.63 RX.A | v14.4,29.26 14.1,29.57 8.46,29.57 IC2.1 | v34.29,24.92 35.05,24.92 37.11,26.98 41.15,26.98 41.83,26.29 41.83,21.41 40.69,20.27 40.69,19.43 SERIAL.2
  Bottom 0.152: 24.54,29.26 24.54,24.92 | 24.54,24.92 v24.54,17.53 | 24.54,29.26 v14.4,29.26 | 24.54,29.26 v24.54,29.49 | 24.54,24.92 v34.29,24.92
SCK
  Top 0.152: U3.17 29.95,9.22 29.95,7.92 26.06,4.04 22.1,4.04 20.04,1.98 J6.6
SIGNAL  (via drill 0.33)
  Top 0.699: T1.3 39.85,65.68 39.85,61.72 40.62,60.96 SERVO.1 | v40.01,41.99 R3.2 | v37.87,56.54 37.87,56.77 v36.73,57.91
  Bottom 0.699: v40.01,41.99 40.01,54.41 v37.87,56.54 | v36.73,57.91 39.78,60.96 SERVO.1
TX
  Top 0.152: 25.79,13.83 25.83,13.79 27.66,13.79 29.22,15.35 | 25.79,13.83 23.77,15.85 23.77,16.31 U3.31 | 29.22,15.35 29.26,15.39 33.22,15.39 33.83,14.78 35.05,14.78 36.35,16.08 36.35,24 39.01,26.67 41,26.67 41.15,26.52 41.15,22.4 40.69,21.95 SERIAL.1 | IC2.5 8.38,26.98 7.7,26.98 5.94,25.22 5.94,21.72 4.88,20.65 4.88,14.86 11.05,8.69 22.1,8.69 24.92,11.51 25.07,11.51 25.76,12.19 25.76,13.79 25.79,13.83 | TX.A 19.05,37.03 20.5,37.03 21.87,38.41 27.36,38.41 28.65,37.11 28.65,36.42 30.18,34.9 30.48,34.9 30.71,34.67 30.71,24.16 28.04,21.49 28.04,18.14 29.18,16.99 29.18,15.39 29.22,15.35
USBVDD  (via drill 0.33)
  Top 0.152: v5.79,20.73 5.79,19.74 J7.VBUS | v4.95,21.57 4.95,25.38 C11.1 4.88,25.45 4.88,28.88 C10.1 | v13.11,24.38 15.62,24.38 IC2.20
  Bottom 0.152: v4.95,21.57 v5.79,20.73 5.79,20.8 9.37,24.38 v13.11,24.38
VCC  (via drill 0.33)
  Top 0.152: STATE.3 7.01,47.02 12.04,47.02 14.55,49.53 STATE.7 14.63,49.53 14.63,52.05 STATE.8 | 22.29,12.08 21.95,12.42 21.49,12.42 U3.4 | 22.29,12.08 22.33,12.04 22.33,11.28 21.95,10.9 21.49,10.9 U3.6 | v33.76,13.03 36.88,16.15 38.56,16.15 U4.8 | 30.94,11.73 30.02,11.73 U3.20 | 30.94,11.73 v32.46,11.73 | 30.94,11.73 30.94,10.52 30.56,10.13 30.02,10.13 U3.18 | v32,22.1 32,26.29 F2.1 31.93,26.36 31.62,26.67 v31.62,30.18 | v26.36,35.43 26.36,37.26 R5.2 | v24.84,12.12 22.33,12.12 22.29,12.08 | v28.12,44.58 28.12,49.3 26.06,51.36 26.06,52.05 STORAGE.8
  Bottom 0.152: STATE.8 15.47,51.21 19.36,51.21 20.19,52.05 25.98,52.05 STORAGE.8 | v32,22.1 32,14.71 33.68,13.03 v33.76,13.03 v32.46,11.73 32.46,11.81 32.16,12.12 v24.84,12.12 | v31.62,30.18 v26.36,35.43 26.44,35.43 28.12,37.11 v28.12,44.58
VDD_IO
  Top 0.152: C8.2 2.13,32.69 3.28,31.55 4.27,31.55 5.94,29.87 5.94,29.49 7.7,27.74 8.38,27.74 IC2.4 8.46,27.66 9.14,27.66 9.45,27.36 9.45,27.2 14.17,22.48 15.62,22.48 IC2.17
VOUT-MOTOR  (via drill 0.33)
  Top 0.699: v17.98,64.62 17.98,62.26 C17.+ | v26.44,60.43 30.33,56.54 F1.2 | R14.2 10.97,70.87 12.19,70.87 18.44,77.11 IC3.2
  Bottom 0.699: v17.98,64.62 17.98,76.73 18.36,77.11 IC3.2 | v26.44,60.43 22.33,60.43 18.29,64.47 v17.98,64.62 | JP5.1 3.2,61.65 14.86,61.65 17.68,64.47 v17.98,64.62

### Text on the board
tNames: + | - | + | - | - | + | - | + | S | - | + | - | + | V | G | - | FEED | + | TX | RX | - | SIG | FEED | - | + | RESET | MOSI | MISO | SCK | SCL | SDA | + | -